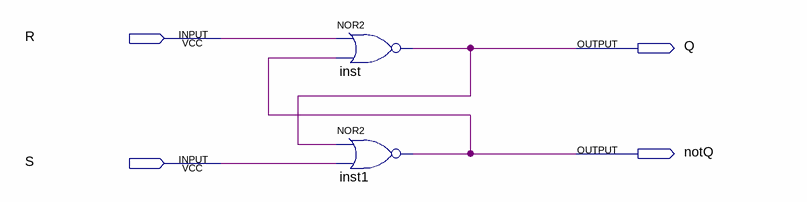
[diagram p0: schematic sheet]
// Quartus schematic RS.bdf as structural Verilog: 2 symbols, 4 pins
module RS (
  input  R,
  input  S,
  output Q,
  output notQ
);

  nor inst (Q, R, notQ);
  nor inst1 (notQ, Q, S);
endmodule
